# EAGLE design shield-ssr-display (EAGLE 6.2)
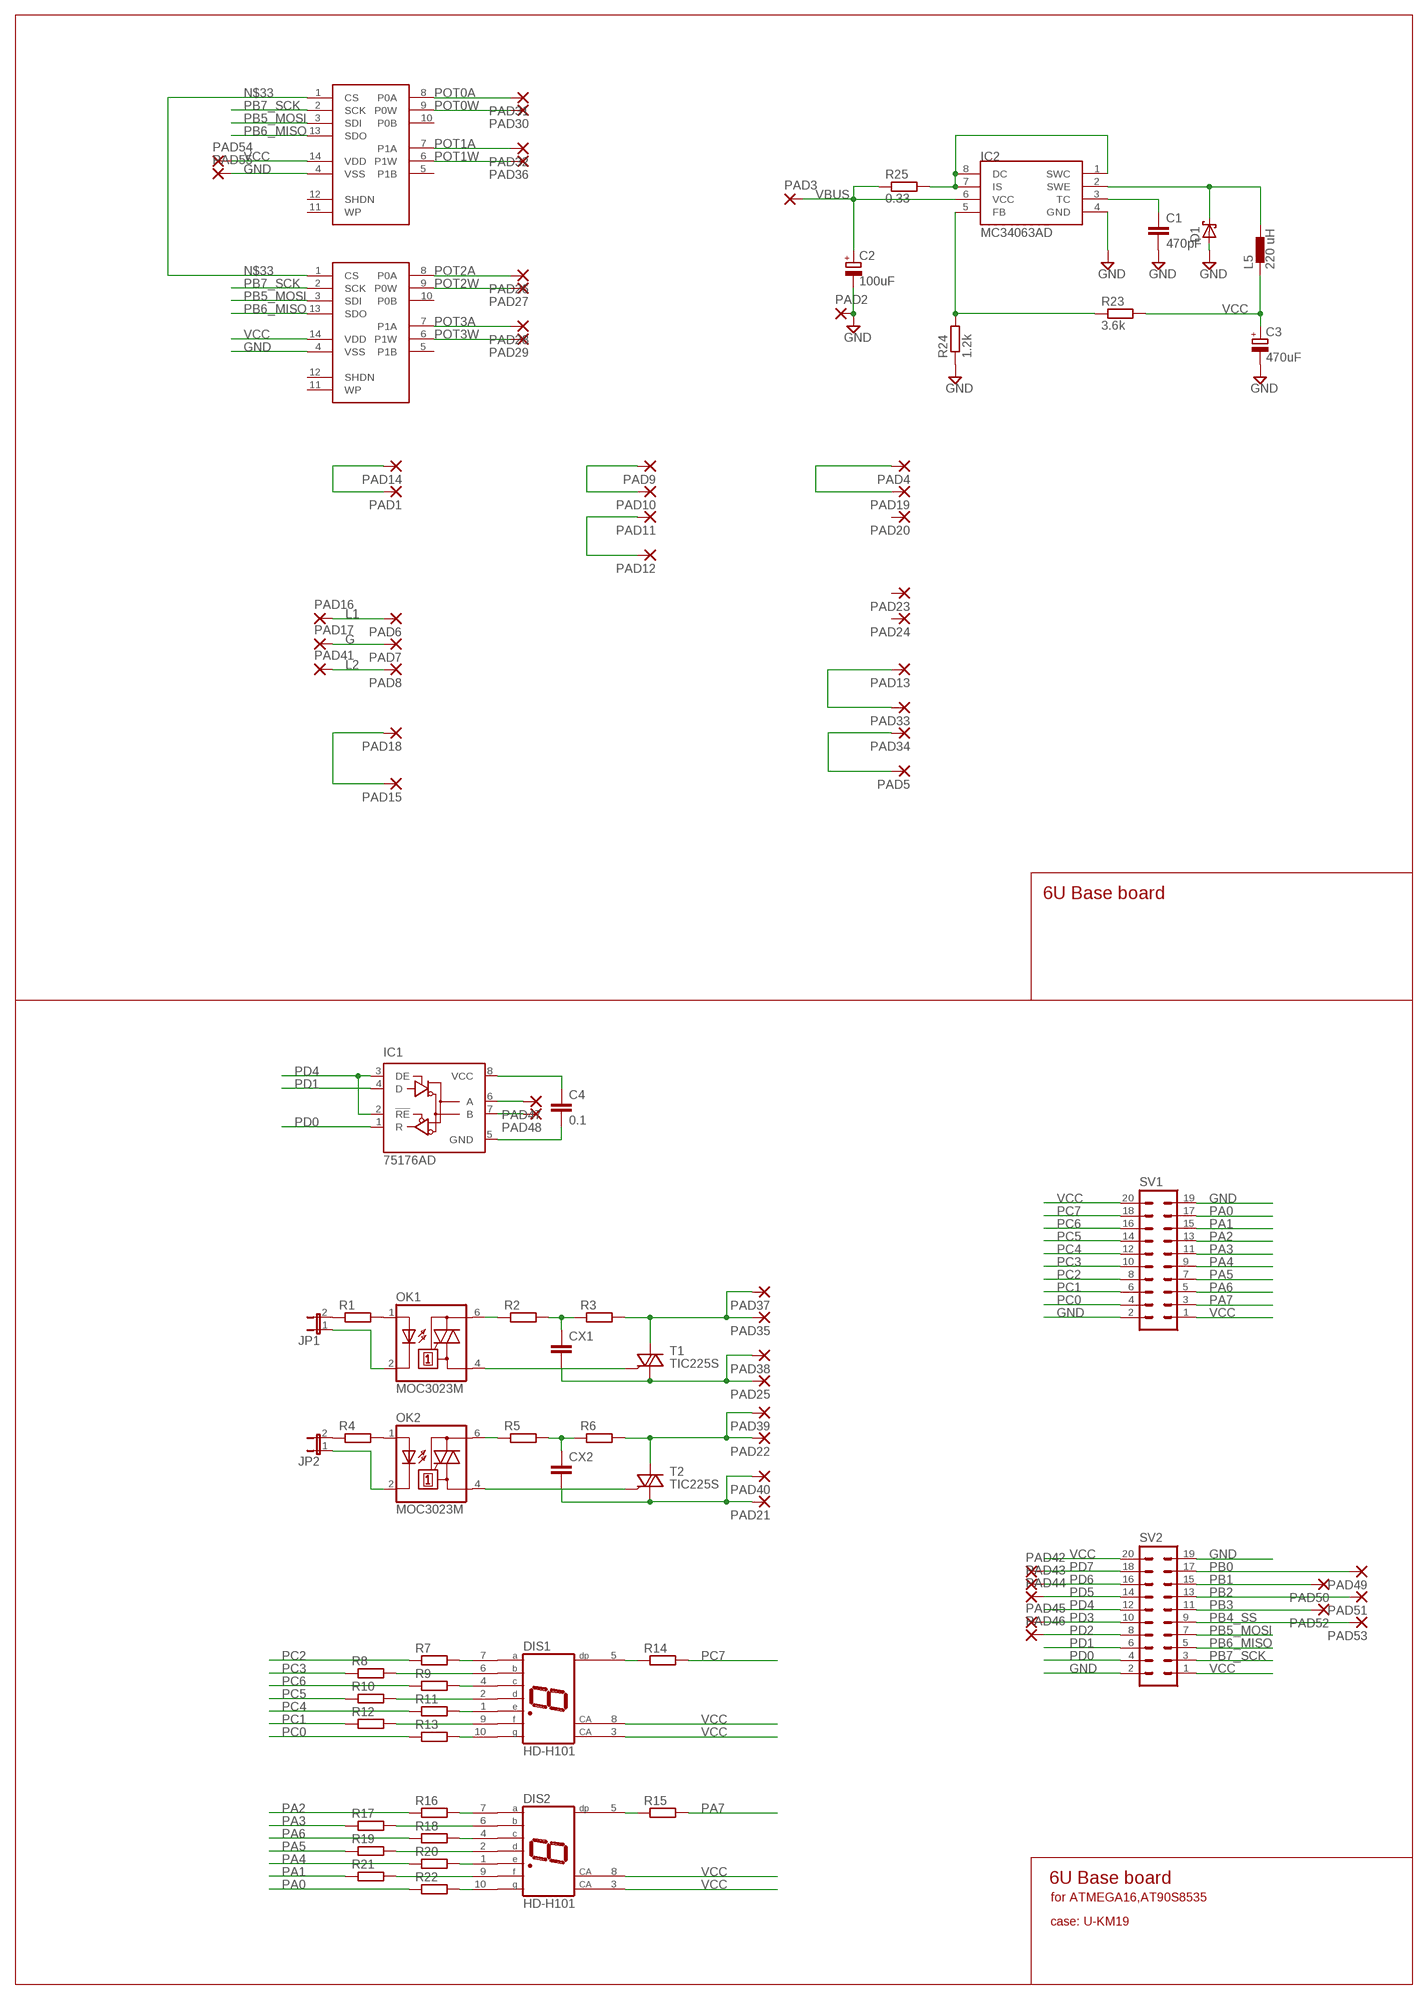
[diagram p0: schematic, sheet 1]

## Parts
C1  470pF  C-EUC0805  [C0805]
C2  100uF  CPOL-EUE3.5-8  [E3,5-8]
C3  470uF  CPOL-EUE3.5-8  [E3,5-8]
C4  0.1  C-EUC0805  [C0805]
CX1  CXXC15B5  [XC15B5]
CX2  CXXC15B5  [XC15B5]
D1  SCHOTTKY-DIODESMD  [SMB]
DIS1  HD-H101  [HDSP-M]
DIS2  HD-H101  [HDSP-M]
IC1  75176AD  [D_R-PDSO-G8]
IC2  MC34063AD  [SOIC8]
JP1  JP1E  [JP1]
JP2  JP1E  [JP1]
L5  220 uH  DR1030  [DR1030]
OK1  MOC3023M  [DIL06]
OK2  MOC3023M  [DIL06]
PAD1  2,54/0,8  [2,54/0,8]
PAD2  2,54/0,8  [2,54/0,8]
PAD3  2,54/0,8  [2,54/0,8]
PAD4  2,54/0,8  [2,54/0,8]
PAD5  2,54/0,8  [2,54/0,8]
PAD6  2,54/0,8  [2,54/0,8]
PAD7  2,54/0,8  [2,54/0,8]
PAD8  2,54/0,8  [2,54/0,8]
PAD9  2,54/0,8  [2,54/0,8]
PAD10  2,54/0,8  [2,54/0,8]
PAD11  2,54/0,8  [2,54/0,8]
PAD12  2,54/0,8  [2,54/0,8]
PAD13  2,54/0,8  [2,54/0,8]
PAD14  2,54/0,8  [2,54/0,8]
PAD15  2,54/0,8  [2,54/0,8]
PAD16  2,54/0,8  [2,54/0,8]
PAD17  2,54/0,8  [2,54/0,8]
PAD18  2,54/0,8  [2,54/0,8]
PAD19  2,54/0,8  [2,54/0,8]
PAD20  2,54/0,8  [2,54/0,8]
PAD21  2,54/0,8  [2,54/0,8]
PAD22  2,54/0,8  [2,54/0,8]
PAD23  2,54/0,8  [2,54/0,8]
PAD24  2,54/0,8  [2,54/0,8]
PAD25  2,54/0,8  [2,54/0,8]
PAD26  2,54/0,8  [2,54/0,8]
PAD27  2,54/0,8  [2,54/0,8]
PAD28  2,54/0,8  [2,54/0,8]
PAD29  2,54/0,8  [2,54/0,8]
PAD30  2,54/0,8  [2,54/0,8]
PAD31  2,54/0,8  [2,54/0,8]
PAD32  2,54/0,8  [2,54/0,8]
PAD33  2,54/0,8  [2,54/0,8]
PAD34  2,54/0,8  [2,54/0,8]
PAD35  2,54/0,8  [2,54/0,8]
PAD36  2,54/0,8  [2,54/0,8]
PAD37  2,54/0,8  [2,54/0,8]
PAD38  2,54/0,8  [2,54/0,8]
PAD39  2,54/0,8  [2,54/0,8]
PAD40  2,54/0,8  [2,54/0,8]
PAD41  2,54/0,8  [2,54/0,8]
PAD42  1,6/0,8  [1,6/0,8]
PAD43  1,6/0,8  [1,6/0,8]
PAD44  1,6/0,8  [1,6/0,8]
PAD45  1,6/0,8  [1,6/0,8]
PAD46  1,6/0,8  [1,6/0,8]
PAD47  1,6/0,8  [1,6/0,8]
PAD48  1,6/0,8  [1,6/0,8]
PAD49  1,6/0,8  [1,6/0,8]
PAD50  1,6/0,8  [1,6/0,8]
PAD51  1,6/0,8  [1,6/0,8]
PAD52  1,6/0,8  [1,6/0,8]
PAD53  1,6/0,8  [1,6/0,8]
PAD54  1,6/0,8  [1,6/0,8]
PAD55  1,6/0,8  [1,6/0,8]
R1  R-EU_M0805  [M0805]
R2  R-EU_R1206  [R1206]
R3  R-EU_R1206  [R1206]
R4  R-EU_M0805  [M0805]
R5  R-EU_R1206  [R1206]
R6  R-EU_R1206  [R1206]
R7  R-EU_R0603  [R0603]
R8  R-EU_R0603  [R0603]
R9  R-EU_R0603  [R0603]
R10  R-EU_R0603  [R0603]
R11  R-EU_R0603  [R0603]
R12  R-EU_R0603  [R0603]
R13  R-EU_R0603  [R0603]
R14  R-EU_R0603  [R0603]
R15  R-EU_R0603  [R0603]
R16  R-EU_R0603  [R0603]
R17  R-EU_R0603  [R0603]
R18  R-EU_R0603  [R0603]
R19  R-EU_R0603  [R0603]
R20  R-EU_R0603  [R0603]
R21  R-EU_R0603  [R0603]
R22  R-EU_R0603  [R0603]
R23  3.6k  R-EU_R0805  [R0805]
R24  1.2k  R-EU_R0805  [R0805]
R25  0.33  R-EU_R1206  [R1206]
SV1  MA10-2  [MA10-2]
SV2  MA10-2  [MA10-2]
T1  TIC225S  [TO220DS]
T2  TIC225S  [TO220DS]
U$1  MCP4231-DIP  [DIL14]
U$2  MCP4231-DIP  [DIL14]

## Nets
G: PAD7.1(P) PAD17.1(P)
GND: C1.2 C2.- C3.- C4.2 D1.A IC1.5(GND) IC2.4(GND) PAD2.1(P) PAD4.1(P) PAD19.1(P) PAD55.1(P) R24.1 SV1.2 SV1.19 SV2.2 SV2.19 U$1.4(VSS) U$2.4(VSS)
L1: PAD6.1(P) PAD16.1(P)
L2: PAD8.1(P) PAD41.1(P)
N$1: OK1.1(A) R1.2
N$2: JP1.2 R1.1
N$3: JP1.1 OK1.2(C)
N$4: OK1.6(A2) R2.1
N$5: CX1.1 R2.2 R3.1
N$6: OK1.4(A1) T1.G
N$7: PAD35.1(P) PAD37.1(P) R3.2 T1.A2
N$8: CX1.2 PAD25.1(P) PAD38.1(P) T1.A1
N$9: OK2.1(A) R4.2
N$10: JP2.2 R4.1
N$11: JP2.1 OK2.2(C)
N$12: OK2.6(A2) R5.1
N$13: OK2.4(A1) T2.G
N$14: PAD22.1(P) PAD39.1(P) R6.2 T2.A2
N$15: DIS1.7(A) R7.2
N$16: CX2.1 R5.2 R6.1
N$17: CX2.2 PAD21.1(P) PAD40.1(P) T2.A1
N$18: DIS1.6(B) R8.2
N$19: DIS1.4(C) R9.2
N$20: DIS1.2(D) R10.2
N$21: DIS1.1(E) R11.2
N$22: DIS1.9(F) R12.2
N$23: DIS1.10(G) R13.2
N$24: DIS1.5(DP) R14.1
N$25: DIS2.7(A) R16.2
N$26: DIS2.6(B) R17.2
N$27: DIS2.4(C) R18.2
N$28: DIS2.2(D) R19.2
N$29: DIS2.1(E) R20.2
N$30: DIS2.9(F) R21.2
N$31: DIS2.10(G) R22.2
N$32: DIS2.5(DP) R15.1
N$33: U$1.1(CS) U$2.1(CS)
N$34: IC2.1(SWC) IC2.7(IS) IC2.8(DC) R25.2
N$35: PAD9.1(P) PAD10.1(P)
N$36: PAD11.1(P) PAD12.1(P)
N$37: D1.C IC2.2(SWE) L5.2
N$38: C1.1 IC2.3(TC)
N$39: IC1.6(A) PAD47.1(P)
N$40: IC2.5(FB) R23.1 R24.2
N$41: PAD13.1(P) PAD33.1(P)
N$42: PAD15.1(P) PAD18.1(P)
N$43: PAD1.1(P) PAD14.1(P)
N$44: IC1.7(B) PAD48.1(P)
PA0: R22.1 SV1.17
PA1: R21.1 SV1.15
PA2: R16.1 SV1.13
PA3: R17.1 SV1.11
PA4: R20.1 SV1.9
PA5: R19.1 SV1.7
PA6: R18.1 SV1.5
PA7: R15.2 SV1.3
PB0: PAD49.1(P) SV2.17
PB1: PAD50.1(P) SV2.15
PB2: PAD51.1(P) SV2.13
PB3: PAD52.1(P) SV2.11
PB4_SS: PAD53.1(P) SV2.9
PB5_MOSI: SV2.7 U$1.3(SDI) U$2.3(SDI)
PB6_MISO: SV2.5 U$1.13(SDO) U$2.13(SDO)
PB7_SCK: SV2.3 U$1.2(SCK) U$2.2(SCK)
PC0: R13.1 SV1.4
PC1: R12.1 SV1.6
PC2: R7.1 SV1.8
PC3: R8.1 SV1.10
PC4: R11.1 SV1.12
PC5: R10.1 SV1.14
PC6: R9.1 SV1.16
PC7: R14.2 SV1.18
PD0: IC1.1(R) SV2.4
PD1: IC1.4(D) SV2.6
PD2: PAD46.1(P) SV2.8
PD3: PAD45.1(P) SV2.10
PD4: IC1.2(!RE) IC1.3(DE) SV2.12
PD5: PAD44.1(P) SV2.14
PD6: PAD43.1(P) SV2.16
PD7: PAD42.1(P) SV2.18
POT0A: PAD31.1(P) U$1.8(P0A)
POT0W: PAD30.1(P) U$1.9(P0W)
POT1A: PAD32.1(P) U$1.7(P1A)
POT1W: PAD36.1(P) U$1.6(P1W)
POT2A: PAD26.1(P) U$2.8(P0A)
POT2W: PAD27.1(P) U$2.9(P0W)
POT3A: PAD28.1(P) U$2.7(P1A)
POT3W: PAD29.1(P) U$2.6(P1W)
VBUS: C2.+ IC2.6(VCC) PAD3.1(P) R25.1
VCC: C3.+ C4.1 DIS1.3(CA) DIS1.8(CA) DIS2.3(CA) DIS2.8(CA) IC1.8(VCC) L5.1 PAD5.1(P) PAD34.1(P) PAD54.1(P) R23.2 SV1.1 SV1.20 SV2.1 SV2.20 U$1.14(VDD) U$2.14(VDD)
Unconnected: PAD20.1(P) PAD23.1(P) PAD24.1(P) U$1.5(P1B) U$1.10(P0B) U$1.11(WP) U$1.12(SHDN) U$2.5(P1B) U$2.10(P0B) U$2.11(WP) U$2.12(SHDN)

## Notes on the sheet
- 6U Base board
- 6U Base board
- for ATMEGA16,AT90S8535
- case: U-KM19

## Library data of the parts
C1 C4 = rcl:C-EU: CAPACITOR, European symbol
C2 C3 = rcl:CPOL-EU: POLARIZED CAPACITOR, European symbol
CX1 CX2 = resistor:CX: X CAPACITOR for power line
D1 = diode:SCHOTTKY-DIODE: Schottky Diode
DIS1 DIS2 = display-hp:HD-H101: LED DISPLAY 1-character 7 segment, decimal point right; OC_FARNELL: unknown; OC_NEWARK: unknown
IC1 = 751xx:75176A: DIFFERENTIAL BUS TRANSCEIVER Source: http://focus.ti.com/lit/ds/symlink/sn75176a.pdf
IC2 = mc34063:MC34063
JP1 JP2 = jumper:JP1E: JUMPER
L5 = inductors:DR1030: DR1030 Series Low Profile Power Inductors Source: Data sheet <http://www.cooperbussmann.com/pdf/c73e479f-f867-4c64-ae26-9c1f23814163.pdf>
OK1 OK2 = optocoupler:MOC30*M: RANDOM-PHASE OPTOISOLATORS TRIAC DRIVER OUTPUT Source: http://www.fairchildsemi.com MOC3020-M.pdf; MF: FAIRCHILD SEMICONDUCTOR; MPN: MOC3023-M; OC_FARNELL: 1021367; OC_NEWARK: 72K8896
PAD1-PAD41 = wirepad:2,54/0,8: THROUGH-HOLE PAD
PAD42-PAD55 = wirepad:1,6/0,8: THROUGH-HOLE PAD
R1-R25 = rcl:R-EU_: RESISTOR, European symbol
SV1 SV2 = con-lstb:MA10-2: PIN HEADER; OC_FARNELL: unknown; OC_NEWARK: unknown
T1 T2 = triac:TIC225S: TRIAC
U$1 U$2 = my-microchip-pot:MCP4231-DIP

## Board
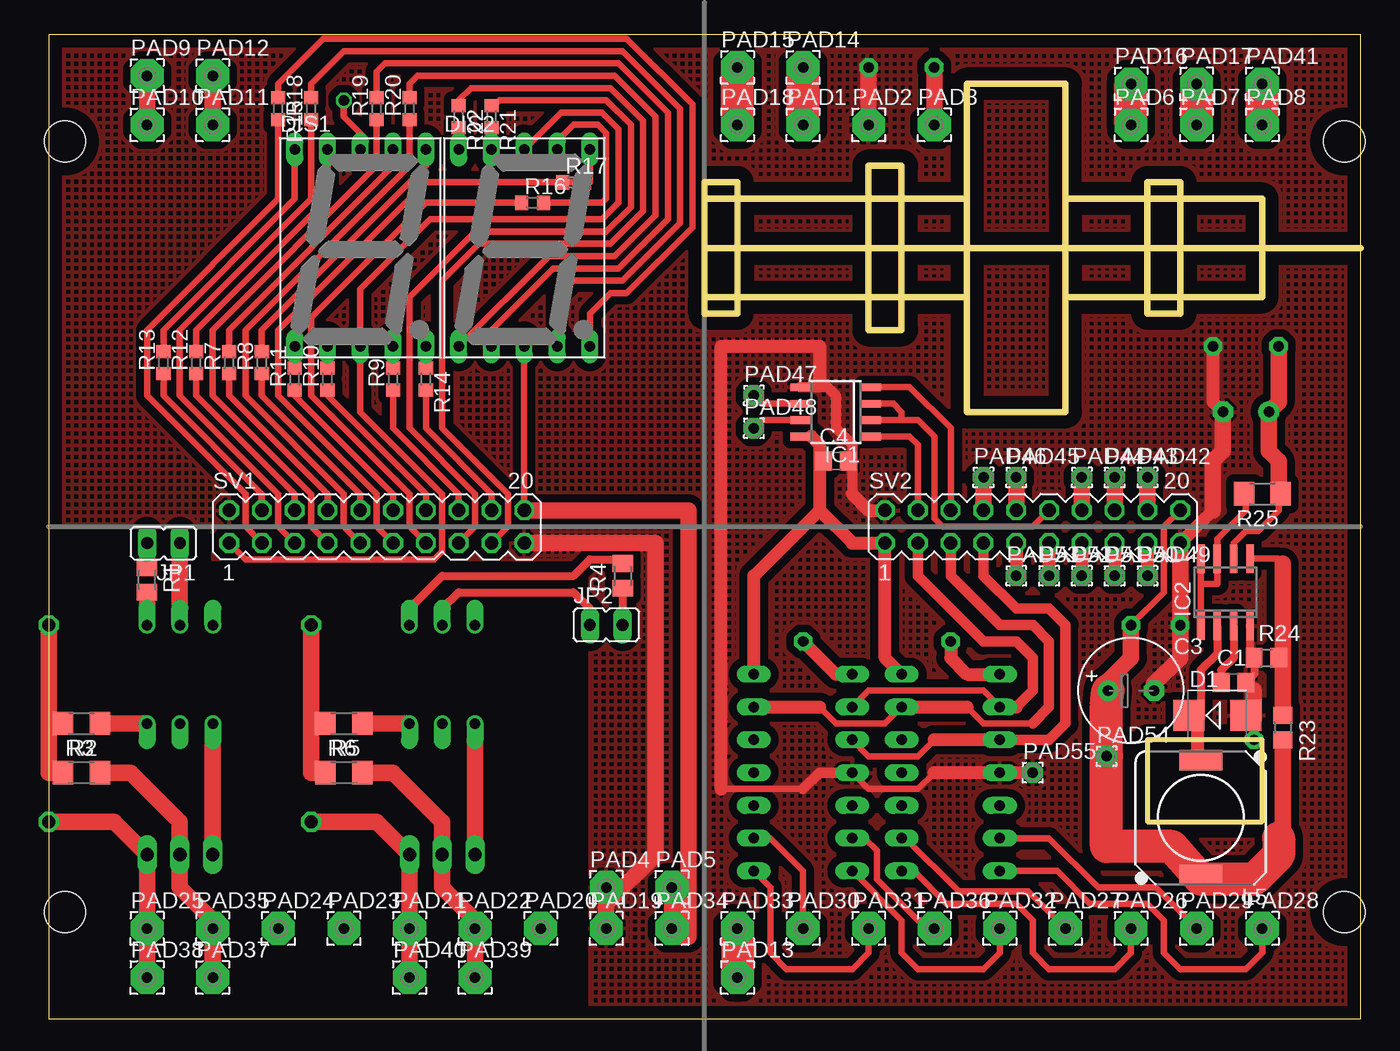
[diagram p1: board, top side]
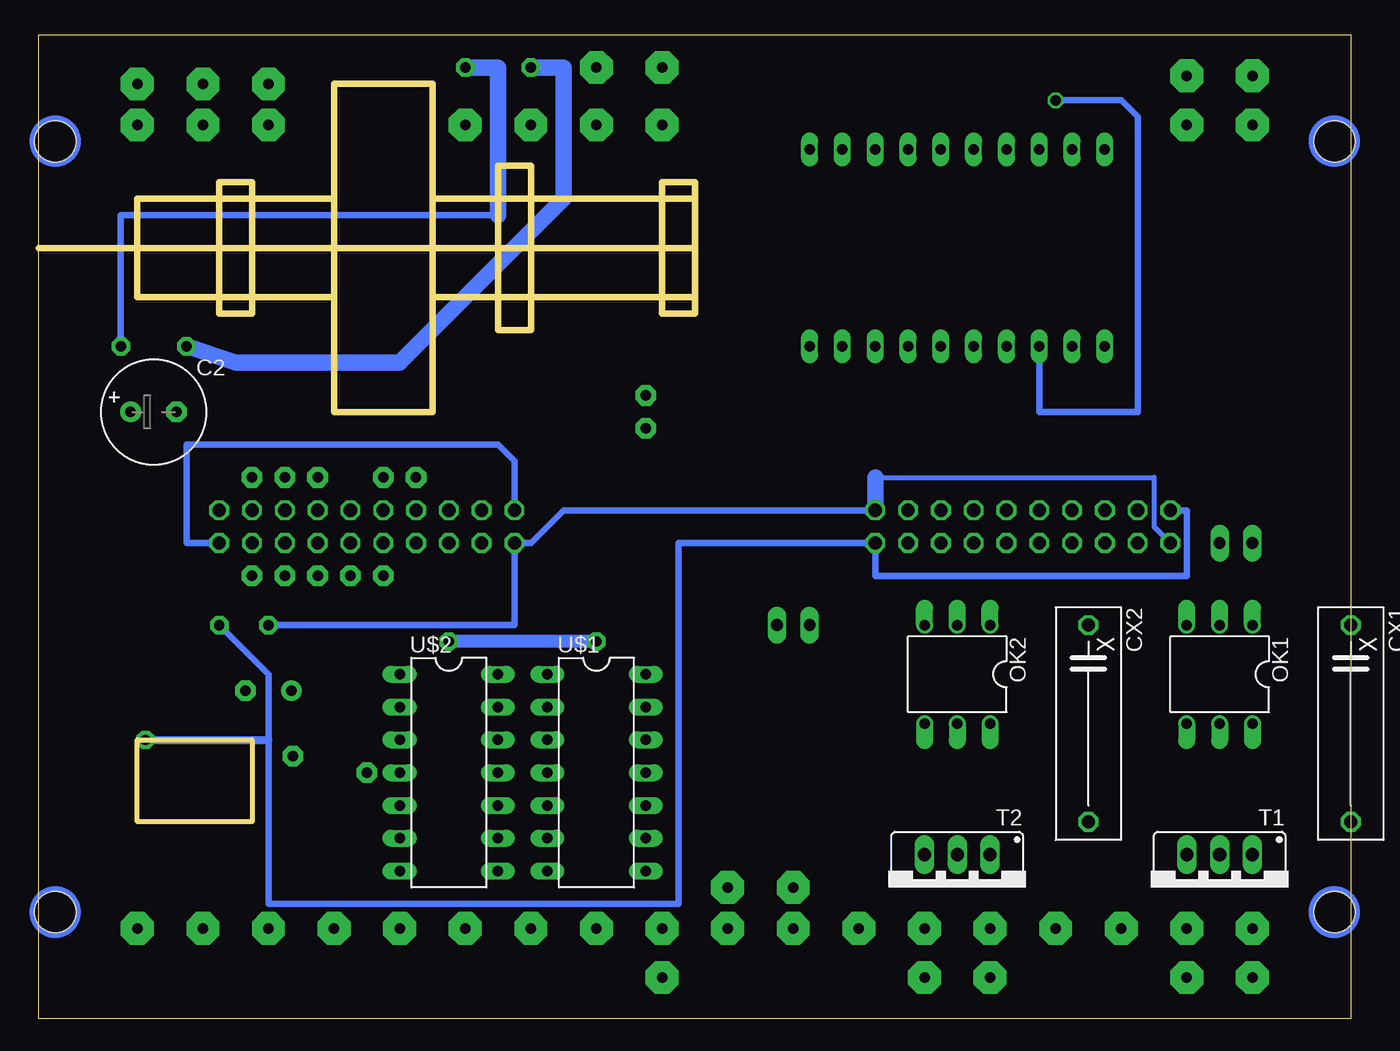
[diagram p2: board, bottom side, seen from below]

Size 101.6 x 76.2 mm. Coordinates in mm from the lower left corner, seen from the top.
Outline: 101.6,59.69 101.6,0 0,0 0,76.2 101.6,76.2 101.6,59.69
Outline: 50.8,59.69 93.98,59.69
Outline: 93.98,59.69 101.6,59.69
Outline: 93.98,59.69 93.98,63.5 78.74,63.5
Outline: 78.74,63.5 78.74,55.88
Outline: 78.74,55.88 93.98,55.88 93.98,59.69
Outline: 78.74,63.5 78.74,72.39 71.12,72.39 71.12,63.5
Outline: 71.12,63.5 71.12,55.88
Outline: 71.12,55.88 71.12,46.99 78.74,46.99 78.74,55.88
Outline: 71.12,63.5 66.04,63.5
Outline: 66.04,63.5 50.8,63.5
Outline: 50.8,63.5 50.8,55.88
Outline: 50.8,55.88 71.12,55.88
Outline: 50.8,63.5 50.8,64.77 53.34,64.77 53.34,54.61 50.8,54.61 50.8,55.88
Outline: 66.04,63.5 66.04,66.04 63.5,66.04 63.5,53.34 66.04,53.34 66.04,63.5
Outline: 85.09,64.77 87.63,64.77 87.63,54.61 85.09,54.61 85.09,64.77
Copper layers (1*16): Top 0.035mm / dielectric 1.5mm / Bottom 0.035mm
Design rules: minimum track width 10mil, minimum drill 24mil, track to track 8mil, track to pad 8mil, pad to pad 8mil, via to via 8mil, smd to smd 8mil, copper to edge 40mil, drill to drill 8mil, minimum pad ring 10mil, minimum via ring 8mil, stop-mask expansion 4mil, vias tented up to drill 0mil, thermal gap 10mil
Holes 3.2 mm at 1.27,8.25 1.27,67.94 100.33,8.25 100.33,67.94
bRestrict: area -2.5,4.4 to 5.1,12.1; area 96.5,4.4 to 104.1,12.1; area -2.5,64.1 to 5.1,71.8; area 96.5,64.1 to 104.1,71.8

### Footprints (pad centres in the part's own frame; a part is rotated, then mirrored left to right if it is on the bottom)
C0805 = smd 1.3 x 1.5: 1 -0.95,0; 2 0.95,0
E3,5-8 = drill 0.813 pad 1.6: + -1.778,0 | drill 0.813 pad 1.6 octagon: - 1.778,0
XC15B5 = drill 1.016 octagon: 1 -7.62,0; 2 7.62,0
SMB = smd 2.4 x 2.4: A 2.2,0; C -2.2,0
HDSP-M = drill 0.813 long: 1 -5.08,-7.62; 2 -2.54,-7.62; 3 0,-7.62; 4 2.54,-7.62; 5 5.08,-7.62; 6 5.08,7.62; 7 2.54,7.62; 8 0,7.62; 9 -2.54,7.62; 10 -5.08,7.62
D_R-PDSO-G8 = smd 0.6 x 1.5: 1 -1.905,-2.75; 2 -0.635,-2.75; 3 0.635,-2.75; 4 1.905,-2.75; 5 1.905,2.75; 6 0.635,2.75; 7 -0.635,2.75; 8 -1.905,2.75
SOIC8 = smd 0.6 x 2.2: 1 -1.905,-2.6; 2 -0.635,-2.6; 3 0.635,-2.6; 4 1.905,-2.6; 5 1.905,2.6; 6 0.635,2.6; 7 -0.635,2.6; 8 -1.905,2.6
JP1 = drill 0.914 long: 1 0,-1.27; 2 0,1.27
DR1030 = smd 3.3 x 1.6: 1 0,4.45; 2 0,-4.45
DIL06 = drill 0.813 offset: 1 -2.54,-3.81; 2 0,-3.81; 3 2.54,-3.81; 4 2.54,3.81; 5 0,3.81; 6 -2.54,3.81
2,54/0,8 = drill 0.813 pad 2.54 octagon: 1 0,0
1,6/0,8 = drill 0.813 pad 1.6 octagon: 1 0,0
M0805 = smd 1.3 x 1.6: 1 -0.95,0; 2 0.95,0
R1206 = smd 1.6 x 1.803: 1 -1.422,0; 2 1.422,0
R0603 = smd 1 x 1.1: 1 -0.85,0; 2 0.85,0
R0805 = smd 1.3 x 1.5: 1 -0.95,0; 2 0.95,0
MA10-2 = drill 1.016 octagon: 1 -11.43,-1.27; 2 -11.43,1.27; 3 -8.89,-1.27; 4 -8.89,1.27; 5 -6.35,-1.27; 6 -6.35,1.27; 7 -3.81,-1.27; 8 -3.81,1.27; 9 -1.27,-1.27; 10 -1.27,1.27; 11 1.27,-1.27; 12 1.27,1.27; 13 3.81,-1.27; 14 3.81,1.27; 15 6.35,-1.27; 16 6.35,1.27; 17 8.89,-1.27; 18 8.89,1.27; 19 11.43,-1.27; 20 11.43,1.27
TO220DS = drill 1.016 long: A1 -2.54,-2.54; A2 0,-2.54; G 2.54,-2.54
DIL14 = drill 0.813 long: 1 -7.62,-3.81; 2 -5.08,-3.81; 3 -2.54,-3.81; 4 0,-3.81; 5 2.54,-3.81; 6 5.08,-3.81; 7 7.62,-3.81; 8 7.62,3.81; 9 5.08,3.81; 10 2.54,3.81; 11 0,3.81; 12 -2.54,3.81; 13 -5.08,3.81; 14 -7.62,3.81

### Placement (x,y rotation side)
C1  91.76,26.04 0 top
C2  92.71,46.99 0 bottom
C3  83.82,25.4 0 top
C4  60.96,43.18 0 top
CX1  0,22.86 270 bottom
CX2  20.32,22.86 270 bottom
D1  90.49,23.5 0 top
DIS1  24.13,59.69 0 top
DIS2  36.83,59.69 0 top
IC1  60.96,46.99 90 top
IC2  91.12,33.02 0 top
JP1  8.89,36.83 90 top
JP2  43.18,30.48 270 top
L5  89.22,15.56 180 top
OK1  10.16,26.67 180 bottom
OK2  30.48,26.67 180 bottom
PAD1  58.42,69.21 0 top
PAD2  63.5,69.21 0 top
PAD3  68.58,69.21 0 top
PAD4  43.18,10.16 0 top
PAD5  48.26,10.16 0 top
PAD6  83.82,69.21 0 top
PAD7  88.9,69.21 0 top
PAD8  93.98,69.21 0 top
PAD9  7.62,73.02 0 top
PAD10  7.62,69.21 0 top
PAD11  12.7,69.21 0 top
PAD12  12.7,73.02 0 top
PAD13  53.34,3.17 0 top
PAD14  58.42,73.66 0 top
PAD15  53.34,73.66 0 top
PAD16  83.82,72.39 0 top
PAD17  88.9,72.39 0 top
PAD18  53.34,69.21 0 top
PAD19  43.18,6.99 0 top
PAD20  38.1,6.99 0 top
PAD21  27.94,6.99 0 top
PAD22  33.02,6.99 0 top
PAD23  22.86,6.99 0 top
PAD24  17.78,6.99 0 top
PAD25  7.62,6.99 0 top
PAD26  83.82,6.99 0 top
PAD27  78.74,6.99 0 top
PAD28  93.98,6.99 0 top
PAD29  88.9,6.99 0 top
PAD30  58.42,6.99 0 top
PAD31  63.5,6.99 0 top
PAD32  73.66,6.99 0 top
PAD33  53.34,6.99 0 top
PAD34  48.26,6.99 0 top
PAD35  12.7,6.99 0 top
PAD36  68.58,6.99 0 top
PAD37  12.7,3.17 0 top
PAD38  7.62,3.17 0 top
PAD39  33.02,3.17 0 top
PAD40  27.94,3.17 0 top
PAD41  93.98,72.39 0 top
PAD42  85.09,41.91 0 top
PAD43  82.55,41.91 0 top
PAD44  80.01,41.91 0 top
PAD45  74.93,41.91 0 top
PAD46  72.39,41.91 0 top
PAD47  54.61,48.26 0 top
PAD48  54.61,45.72 0 top
PAD49  85.09,34.29 0 top
PAD50  82.55,34.29 0 top
PAD51  80.01,34.29 0 top
PAD52  77.47,34.29 0 top
PAD53  74.93,34.29 0 top
PAD54  81.92,20.32 0 top
PAD55  76.2,19.05 0 top
R1  7.62,33.97 270 top
R2  2.54,22.86 180 top
R3  2.54,19.05 0 top
R4  44.45,34.29 90 top
R5  22.86,22.86 180 top
R6  22.86,19.05 0 top
R7  13.97,50.8 90 top
R8  16.51,50.8 90 top
R9  26.67,49.53 90 top
R10  21.59,49.53 90 top
R11  19.05,49.53 90 top
R12  11.43,50.8 90 top
R13  8.89,50.8 90 top
R14  29.21,49.53 270 top
R15  17.78,70.48 270 top
R16  37.47,63.18 0 top
R17  40.64,64.77 0 top
R18  20.32,70.48 90 top
R19  25.4,70.48 90 top
R20  27.94,70.48 90 top
R21  34.29,69.85 270 top
R22  31.75,69.85 270 top
R23  95.57,22.54 270 top
R24  94.3,27.94 0 top
R25  93.98,40.64 180 top
SV1  25.4,38.1 0 top
SV2  76.2,38.1 0 top
T1  10.16,10.16 180 bottom
T2  30.48,10.16 180 bottom
U$1  58.42,19.05 270 bottom
U$2  69.85,19.05 270 bottom

### Tracks (layer width: path | path; a pad name or v marks a point on that pad's centre or on a via)
G
  Top 2.54: PAD7.1 PAD17.1
GND  (via drill 0.8 pad 1.42)
  Top 0.508: C1.2 93.32,25.42 | 68.58,19.05 67.31,17.78 63.5,17.78 U$1.4 | 58.42,17.78 52.07,17.78 | 59.69,49.53 60.33,48.9
  Top 0.61: IC2.4 93.03,28.26 R24.1 93.35,26.68 C1.2 | 93.32,23.18 93.32,22.86 93.32,21.61 v93.34,21.59
  Top 0.813: U$1.4 59.69,19.05 58.42,17.78 | 62.23,40.64 62.23,42.86 | 62.23,42.86 C4.2 | 62.23,42.86 62.23,44.45 60.96,45.72 60.96,48.26 60.33,48.9 IC1.5
  Top 1.016: 62.23,40.64 63.5,39.37 SV2.2 | 68.58,19.05 U$2.4 PAD55.1 | 52.07,17.78 52.07,52.07 59.69,52.07 59.69,49.53 | v90.17,52.07 90.17,47.75 C2.- | SV2.19 90.17,39.37 | D1.A 93.32,22.86
  Top 1.27: PAD4.1 PAD19.1 43.18,8.89 46.99,12.7 46.99,36.83 SV1.19 | PAD2.1 v63.5,73.66 | 93.32,25.42 93.32,23.18 | C2.- 90.93,43.94 90.17,43.18 90.17,39.37 | C3.- 85.6,25.91 87.63,27.94 v87.63,30.48 SV2.19
  Bottom 0.508: SV1.2 12.7,39.37 12.7,34.29 36.83,34.29 SV1.19 52.07,36.83 52.07,8.89 83.82,8.89 83.82,21.59 83.82,26.67 v87.63,30.48 | SV2.2 64.77,43.18 66.04,44.45 90.17,44.45 90.17,36.83 SV2.19
  Bottom 0.61: v93.34,21.59 83.82,21.59
  Bottom 1.27: v90.17,52.07 86.36,50.8 73.66,50.8 60.96,63.5 60.96,73.66 v63.5,73.66
  pour Top (isolate 0.61, hatched): 41.91,0 50.8,0 50.8,76.2 0,76.2 0,38.1 12.7,38.1 12.7,35.56 41.91,35.56
  pour Top (isolate 0.61, hatched): 50.8,0 101.6,0 101.6,76.2 50.8,76.2
L1
  Top 1.016: 83.99,72.56 PAD16.1
  Top 2.54: PAD6.1 PAD16.1
L2
  Top 2.54: PAD8.1 PAD41.1
N$1
  Top 1.27: OK1.1 R1.2
N$2
  Top 1.27: R1.1 JP1.2
N$3
  Top 1.27: JP1.1 OK1.2
N$4
  Top 1.27: R2.1 OK1.6
N$5
  Top 1.27: CX1.1 0,22.86 | 0,22.86 R2.2 | R3.1 0,19.05 0,22.86
N$6
  Top 1.27: T1.G OK1.4
N$7
  Top 1.27: R3.2 6.35,19.05 10.16,15.24 T1.A2 10.16,10.16 12.7,7.62 PAD35.1 PAD37.1
N$8
  Top 1.27: CX1.2 5.08,15.24 T1.A1 PAD25.1 PAD38.1
N$9
  Top 0.61: OK2.1 27.94,31.75 30.48,34.29 40.64,34.29 41.91,35.56 44.13,35.56 R4.2
N$10
  Top 0.61: R4.1 JP2.2
N$11
  Top 0.61: OK2.2 30.48,31.75 31.75,33.02 40.64,33.02 41.91,31.75 JP2.1
N$12
  Top 1.27: R5.1 OK2.6
N$13
  Top 1.27: OK2.4 T2.G
N$14
  Top 1.27: R6.2 26.67,19.05 30.48,15.24 T2.A2 30.48,10.16 33.02,7.62 PAD22.1 PAD39.1
N$15
  Top 0.508: R7.2 13.97,53.34 26.67,66.04 DIS1.7
N$16
  Top 1.27: CX2.1 20.32,22.86 | 20.32,22.86 R5.2 | R6.1 20.32,19.05 20.32,22.86
N$17
  Top 1.27: CX2.2 25.4,15.24 T2.A1 PAD21.1 PAD40.1
N$18
  Top 0.508: R8.2 16.51,53.34 29.21,66.04 DIS1.6
N$19
  Top 0.508: R9.2 DIS1.4
N$20
  Top 0.508: R10.2 DIS1.2
N$21
  Top 0.508: R11.2 DIS1.1
N$22
  Top 0.508: R12.2 11.43,53.34 21.59,63.5 DIS1.9
N$23
  Top 0.508: R13.2 8.89,53.34 19.05,63.5 DIS1.10
N$24
  Top 0.508: R14.1 DIS1.5
N$25
  Top 0.508: DIS2.7 39.37,67.94 40.64,69.21 42.55,69.21 43.18,68.58 43.18,63.5 42.86,63.18 R16.2
N$26
  Top 0.508: DIS2.6 41.91,64.77 R17.2
N$27
  Top 0.508: DIS2.4 39.37,55.88 40.64,57.15 44.45,57.15 48.9,61.6 48.9,70.48 44.45,74.93 22.86,74.93 20.32,72.39 R18.2
N$28
  Top 0.508: R19.2 25.4,73.34 26.04,73.98 44.13,73.98 47.94,70.17 47.94,61.91 44.13,58.1 39.05,58.1 34.29,53.34 DIS2.2
N$29
  Top 0.508: DIS2.1 38.73,59.05 43.81,59.05 46.99,62.23 46.99,69.85 43.81,73.02 28.57,73.02 27.94,72.39 R20.2
N$30
  Top 0.508: R21.2 DIS2.9
N$31
  Top 0.508: R22.2 DIS2.10
N$32
  Top 0.508: DIS2.5 41.91,54.61 43.5,56.2 44.77,56.2 49.85,61.28 49.85,70.8 44.77,75.88 21.27,75.88 17.78,72.39 R15.1
N$33  (via drill 0.8 pad 1.42)
  Top 1.016: U$1.1 60.96,26.67 v58.42,29.21 | v69.85,29.21 69.85,27.94 71.12,26.67 U$2.1
  Bottom 1.016: v58.42,29.21 v69.85,29.21
N$34
  Top 0.508: IC2.8 89.22,33.66 | 89.22,33.66 IC2.1 | 89.22,33.66 90.49,33.66 IC2.7 90.49,37.15 92.71,39.37 92.71,40.49 R25.2
N$35
  Top 1.27: PAD10.1 PAD9.1
N$36
  Top 1.27: PAD11.1 PAD12.1
N$37
  Top 0.508: 89.22,22.84 88.94,22.75 88.86,22.83 D1.C
  Top 0.61: IC2.2 90.49,28.26 89.22,26.99 89.22,23.18 88.86,22.83
  Top 1.016: 88.94,22.75 88.94,19.97 L5.2
N$38
  Top 0.61: IC2.3 91.76,27.94 90.81,26.99 C1.1
N$39
  Top 0.508: IC1.6 55.24,47.62 PAD47.1
N$40
  Top 0.508: IC2.5 95.19,35.62 95.57,35.24
  Top 1.016: R23.1 95.57,27.62 R24.2
  Top 1.27: R23.1 95.57,35.24
N$41
  Top 2.54: PAD33.1 PAD13.1
N$42
  Top 2.54: PAD18.1 PAD15.1
N$43
  Top 2.54: PAD1.1 PAD14.1
N$44
  Top 0.508: IC1.7 55.24,46.36 PAD48.1
PA0
  Top 0.508: SV1.17 35.56,38.1 35.56,40.64 30.48,45.72 30.48,57.15 33.34,60.01 43.5,60.01 46.04,62.55 46.04,69.53 43.5,72.07 32.7,72.07 31.75,71.12 R22.1
PA1
  Top 0.508: SV1.15 33.02,38.1 33.02,40.64 27.94,45.72 27.94,55.88 33.02,60.96 43.18,60.96 45.09,62.87 45.09,69.21 43.18,71.12 34.92,71.12 34.51,70.7 R21.1
PA2
  Top 0.508: SV1.13 27.94,38.1 27.94,40.64 20.32,48.26 20.32,54.29 29.21,63.18 R16.1
PA3
  Top 0.508: SV1.11 25.4,38.1 25.4,40.64 17.78,48.26 17.78,53.34 29.21,64.77 R17.1 40.64,64.77 41.91,64.77
PA4
  Top 0.508: SV1.9 22.86,38.1 22.86,40.64 15.24,48.26 15.24,53.34 27.94,66.04 R20.1
PA5
  Top 0.508: SV1.7 20.32,38.1 20.32,40.64 12.7,48.26 12.7,53.34 25.4,66.04 R19.1
PA6
  Top 0.508: SV1.5 17.78,38.1 17.78,40.64 10.16,48.26 10.16,53.34 20.32,63.5 R18.1
PA7
  Top 0.508: SV1.3 15.24,38.1 15.24,40.64 7.62,48.26 7.62,53.34 17.78,63.5 R15.2
PB0
  Top 1.016: SV2.17 PAD49.1
PB1
  Top 1.016: SV2.15 PAD50.1
PB2
  Top 1.016: SV2.13 PAD51.1
PB3
  Top 1.016: SV2.11 PAD52.1
PB4_SS
  Top 1.016: SV2.9 PAD53.1
PB5_MOSI
  Top 0.508: 68.58,21.59 67.31,20.32 63.5,20.32 U$1.3
  Top 0.813: U$2.3 77.47,21.59 78.74,22.86 78.74,30.48 77.47,31.75 74.93,31.75 72.39,34.29 SV2.7
  Top 1.016: U$2.3 68.58,21.59
PB6_MISO
  Top 0.508: 59.69,24.13 60.96,22.86 64.77,22.86 U$2.13 | 71.12,24.13 72.39,22.86 76.2,22.86
  Top 0.813: 76.2,22.86 77.47,24.13 77.47,29.21 76.2,30.48 73.66,30.48 69.85,34.29 SV2.5
  Top 1.016: U$1.13 59.69,24.13 | U$2.13 71.12,24.13
PB7_SCK
  Top 0.508: U$1.2 63.5,25.4 72.39,25.4 U$2.2
  Top 0.813: 74.93,24.13 76.2,25.4 76.2,27.94 74.93,29.21 72.39,29.21 67.31,34.29 SV2.3
  Top 1.016: U$2.2 74.93,24.13
PC0
  Top 0.508: SV1.4 16.51,40.64 8.89,48.26 R13.1
PC1
  Top 0.508: SV1.6 19.05,40.64 11.43,48.26 R12.1
PC2
  Top 0.508: SV1.8 21.59,40.64 13.97,48.26 R7.1
PC3
  Top 0.508: SV1.10 24.13,40.64 16.51,48.26 R8.1
PC4
  Top 0.508: SV1.12 26.67,40.64 19.05,48.26 R11.1
PC5
  Top 0.508: SV1.14 29.21,40.64 21.59,48.26 R10.1
PC6
  Top 0.508: SV1.16 31.75,40.64 26.67,45.72 R9.1
PC7
  Top 0.508: SV1.18 34.29,40.64 29.21,45.72 R14.2
PD0
  Top 0.508: IC1.1 66.67,45.09 67.31,44.45 SV2.4
PD1
  Top 0.508: IC1.4 66.67,48.9 69.85,45.72 SV2.6
PD2
  Top 1.27: SV2.8 PAD46.1
PD3
  Top 1.27: SV2.10 PAD45.1
PD4
  Top 0.508: IC1.2 66.04,46.36 | 66.04,46.36 67.31,46.36 68.58,45.09 68.58,38.73 69.22,38.1 76.2,38.1 SV2.12 | IC1.3 65.41,47.62 66.04,46.99 66.04,46.36
PD5
  Top 1.27: SV2.14 PAD44.1
PD6
  Top 1.27: SV2.16 PAD43.1
PD7
  Top 1.27: SV2.18 PAD42.1
POT0A
  Top 0.508: U$1.8 55.88,10.16 55.88,5.08 57.15,3.81 62.23,3.81 63.5,5.08 PAD31.1
POT0W
  Top 0.508: U$1.9 55.88,13.97 58.42,11.43 PAD30.1
POT1A
  Top 0.508: U$1.7 66.04,7.62 66.04,5.08 67.31,3.81 72.39,3.81 73.66,5.08 PAD32.1
POT1W
  Top 0.508: U$1.6 63.18,13.97 64.14,13.02 64.14,10.8 67.31,7.62 67.94,7.62 PAD36.1
POT2A
  Top 0.508: U$2.8 66.99,11.43 69.53,8.89 74.93,8.89 76.2,7.62 76.2,5.08 77.47,3.81 82.55,3.81 83.82,5.08 PAD26.1
POT2W
  Top 0.508: U$2.9 66.36,13.97 70.48,9.84 75.88,9.84 PAD27.1
POT3A
  Top 0.508: U$2.7 78.11,11.43 80.64,8.89 85.09,8.89 86.36,7.62 86.36,5.08 87.63,3.81 92.71,3.81 93.98,5.08 PAD28.1
POT3W
  Top 0.508: U$2.6 77.47,13.97 81.28,10.16 85.72,10.16 PAD29.1
VBUS  (via drill 0.8 pad 1.42)
  Top 0.508: IC2.6 91.76,36.83 92.71,37.78 93.66,37.78 95.25,39.37 95.25,40.49 R25.1
  Top 1.27: PAD3.1 v68.58,73.66 | v95.25,52.07 95.25,47.75 C2.+ 94.49,43.94 95.25,43.18 95.25,40.79 R25.1
  Bottom 0.508: v95.25,52.07 95.25,62.23 66.04,62.23
  Bottom 1.27: v68.58,73.66 66.04,73.66 66.04,62.23
VCC  (via drill 0.8, 0.8 pad 1.42)
  Top 0.508: SV1.1 15.24,35.56 29.84,35.56 30.48,36.2 30.48,40.64 24.13,46.99 DIS1.3 24.13,56.52 29.53,61.91 42.86,61.91 44.13,63.18 44.13,68.9 42.86,70.17 39.69,70.17 DIS2.8 | DIS2.3 SV1.20 | DIS1.8 24.13,68.58 22.86,69.85 v22.86,71.12 | SV2.20 86.36,38.1 86.36,33.02 v83.82,30.48 | IC1.8 59.05,45.09
  Top 1.016: 59.05,45.09 59.69,44.45 59.69,43.5 | 59.69,43.5 59.69,39.37 | 59.69,39.37 62.23,36.83 SV2.1 64.77,27.94 U$2.14 | U$1.14 54.61,34.29 59.69,39.37 | PAD54.1 81.92,25.27 C3.+ | 59.69,43.5 C4.1
  Top 1.27: PAD5.1 PAD34.1 48.26,6.35 49.53,6.35 49.53,39.37 SV1.20 | R23.2 95.57,14.29 95.25,13.97 | L5.1 89.22,10.8 | C3.+ 82.04,26.16 83.82,27.94 v83.82,30.48
  Top 2.54: 95.25,13.97 95.25,12.7 93.34,10.8 89.22,10.8 87,13.34 81.92,13.34 PAD54.1 81.92,24.26 C3.+
  Bottom 0.406: 36.83,41.91 15.24,41.91 15.24,38.1 SV1.1
  Bottom 0.508: v22.86,71.12 17.78,71.12 16.51,69.85 16.51,46.99 24.13,46.99 DIS1.3 | SV1.20 60.96,39.37 63.5,36.83 SV2.1 64.77,30.48 v83.82,30.48
  Bottom 1.27: SV1.20 36.83,41.91
(copper drawn outside any net)
  shapes: Bottom circle x4